# EAGLE design PIC32-RETROBSD_Rev.A (EAGLE 4.16)
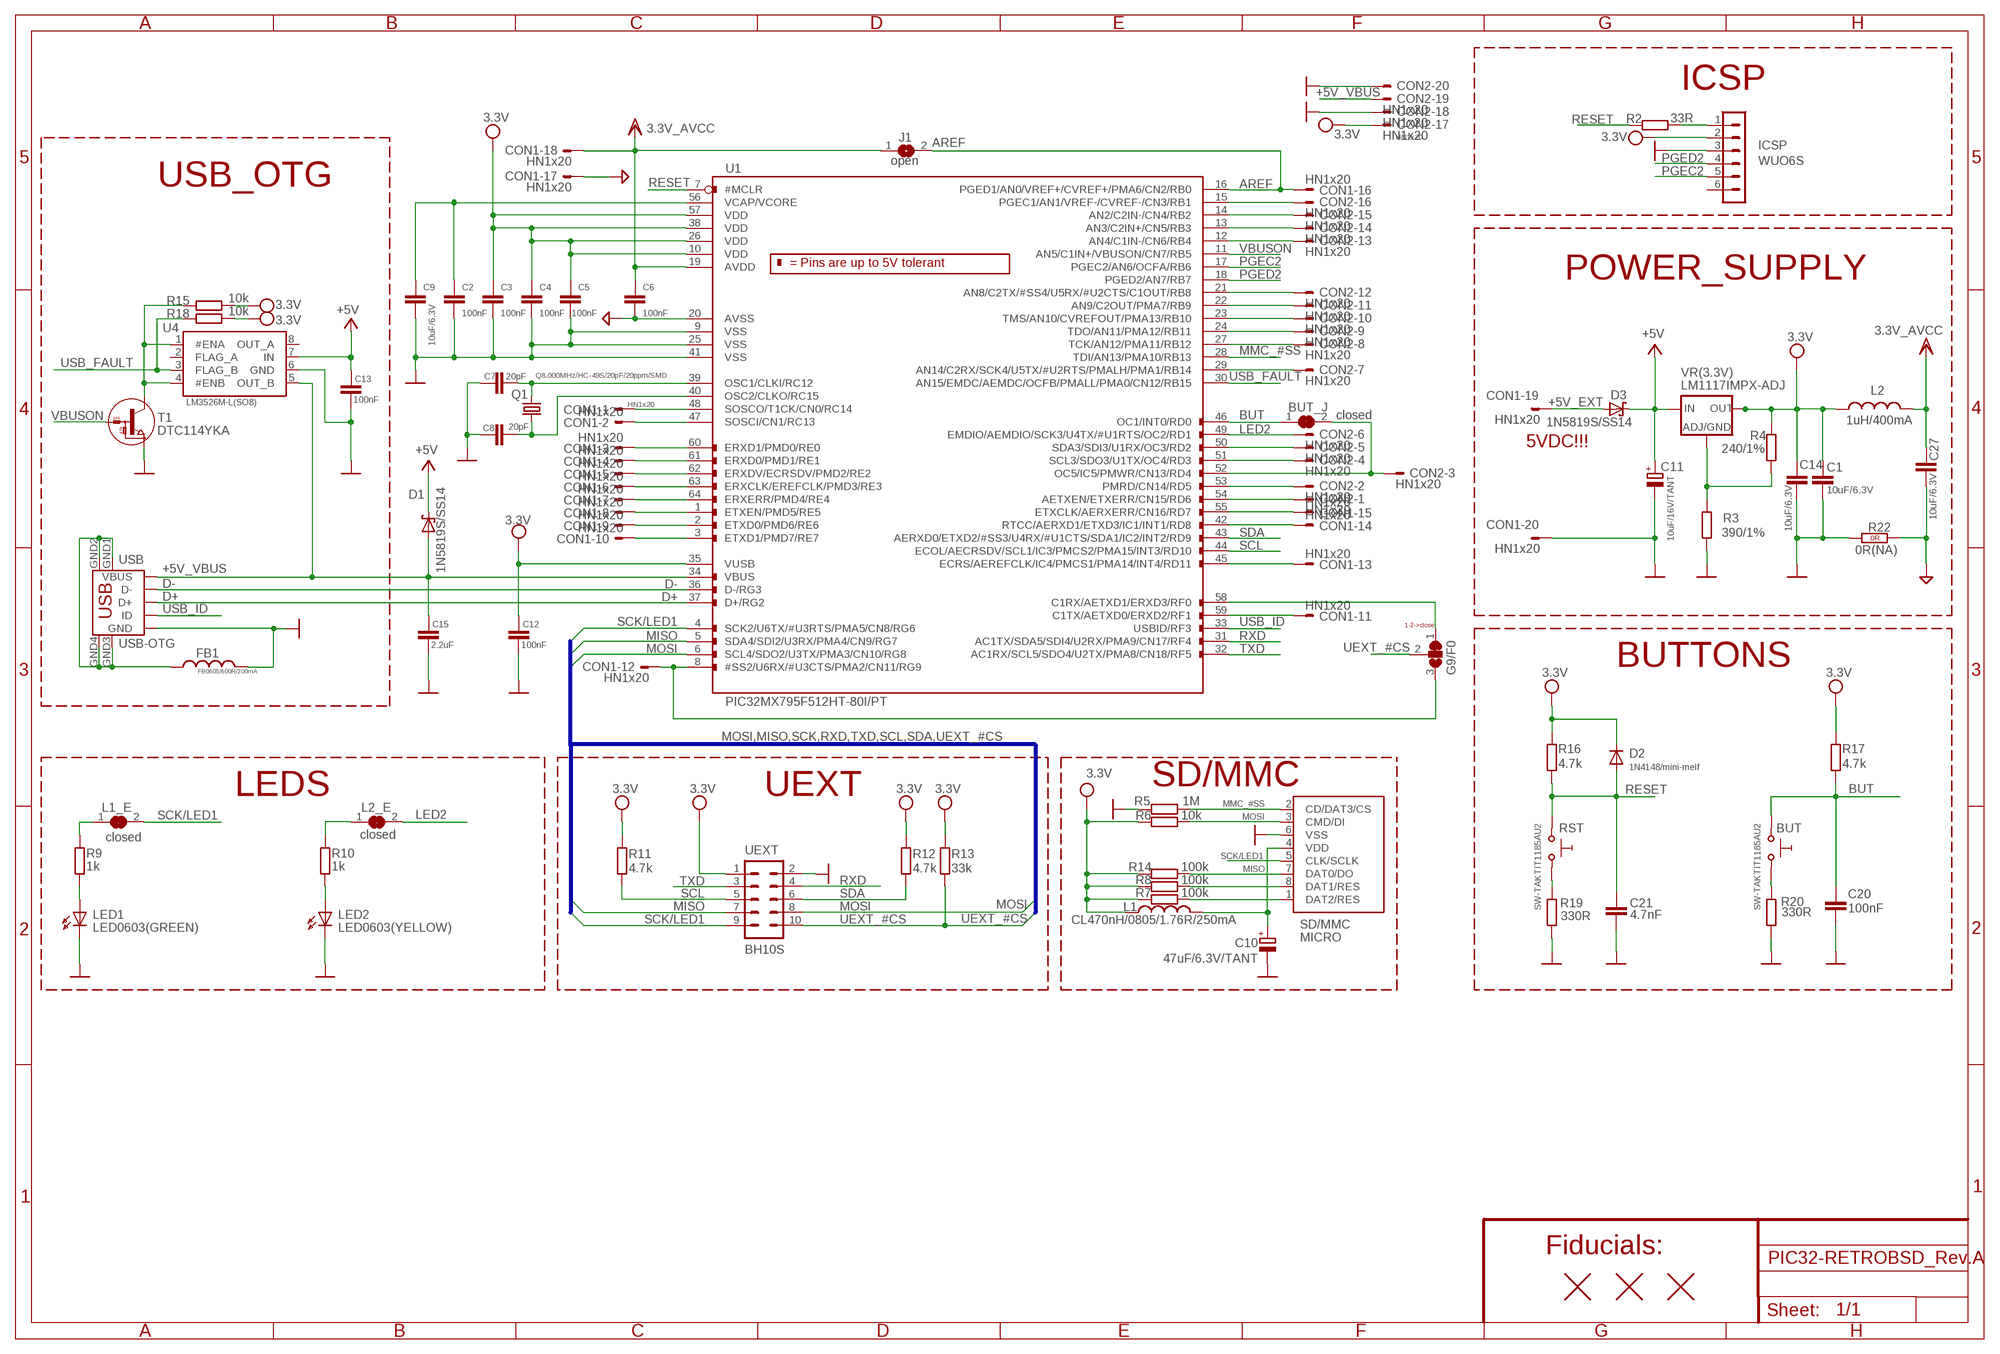
[diagram p0: schematic, sheet 1]

## Parts
BUT  SW-TAKTIT1185AU2  [IT1185AU2]
BUT_J  closed  SJSJ_1_SMALLER_CLOSE  [SJ_1_SMALLER_CLOSE]
C1  10uF/6.3V  C-EUC0805_5MIL  [C0805_5MIL]
C2  100nF  C-EUC0603_5MIL  [C0603_5MIL]
C3  100nF  C-EUC0603_5MIL  [C0603_5MIL]
C4  100nF  C-EUC0603_5MIL  [C0603_5MIL]
C5  100nF  C-EUC0603_5MIL  [C0603_5MIL]
C6  100nF  C-EUC0603_5MIL  [C0603_5MIL]
C7  20pF  C-EUC0603_5MIL  [C0603_5MIL]
C8  20pF  C-EUC0603_5MIL  [C0603_5MIL]
C9  10uF/6.3V  C-EUC0805_5MIL  [C0805_5MIL]
C10  47uF/6.3V/TANT  CPOL-EUCT3528  [CT3528]
C11  10uF/16V/TANT  CPOL-EUCT3528  [CT3528]
C12  100nF  C-EUC0603_5MIL  [C0603_5MIL]
C13  100nF  C-EUC0603_5MIL  [C0603_5MIL]
C14  10uF/6.3V  C-EUC0805_5MIL  [C0805_5MIL]
C15  2.2uF  C-EUC0603_5MIL  [C0603_5MIL]
C20  100nF  C-EUC0603_5MIL  [C0603_5MIL]
C21  4.7nF  C-EUC0603_5MIL  [C0603_5MIL]
C27  10uF/6.3V  C-EUC0805_5MIL  [C0805_5MIL]
CON1  HN1x20  CON20X1_2  [CON20X1]
CON2  HN1x20  CON20X1_2  [CON20X1]
D1  1N5819S/SS14  SCHOTKKY7.62SS2  [MLL-41]
D2  1N4148/mini-melf  DSMD  [MINI-MELF]
D3  1N5819S/SS14  SCHOTKKY7.62SS2  [MLL-41]
FB1  FB0605/600R/200mA  L-USL0603  [L0603]
G9/F0  SJ2W3  [SJ_2_SMALL]
ICSP  WUO6S  CON6WUO6S  [WU06S]
J1  open  SJSJ_SMALLER  [SJ_1_SMALLER]
L1  CL470nH/0805/1.76R/250mA  L-USL0805_5MIL  [L0805_5MIL]
L1_E  closed  SJSJ_1_SMALLER_CLOSE  [SJ_1_SMALLER_CLOSE]
L2  1uH/400mA  L-USL3216C  [L3216C]
L2_E  closed  SJSJ_1_SMALLER_CLOSE  [SJ_1_SMALLER_CLOSE]
LED1  LED0603(GREEN)  LED0603DWS  [LED-0603]
LED2  LED0603(YELLOW)  LED0603DWS  [LED-0603]
Q1  Q8.000MHz/HC-49S/20pF/20ppm/SMD  HC49/S1  [HC49/SMD2_THIN]
R2  33R  R-EU_R0603_5MIL  [R0603_5MIL]
R3  390/1%  R-EU_R0603_5MIL  [R0603_5MIL]
R4  240/1%  R-EU_R0603_5MIL  [R0603_5MIL]
R5  1M  R-EU_R0603_5MIL  [R0603_5MIL]
R6  10k  R-EU_R0603_5MIL  [R0603_5MIL]
R7  100k  R-EU_R0603_5MIL  [R0603_5MIL]
R8  100k  R-EU_R0603_5MIL  [R0603_5MIL]
R9  1k  R-EU_R0603_5MIL  [R0603_5MIL]
R10  1k  R-EU_R0603_5MIL  [R0603_5MIL]
R11  4.7k  R-EU_R0603_5MIL  [R0603_5MIL]
R12  4.7k  R-EU_R0603_5MIL  [R0603_5MIL]
R13  33k  R-EU_R0603_5MIL  [R0603_5MIL]
R14  100k  R-EU_R0603_5MIL  [R0603_5MIL]
R15  10k  R-EU_R0603_5MIL  [R0603_5MIL]
R16  4.7k  R-EU_R0603_5MIL  [R0603_5MIL]
R17  4.7k  R-EU_R0603_5MIL  [R0603_5MIL]
R18  10k  R-EU_R0603_5MIL  [R0603_5MIL]
R19  330R  R-EU_R0603_5MIL  [R0603_5MIL]
R20  330R  R-EU_R0603_5MIL  [R0603_5MIL]
R22  0R(NA)  R_0R0R(NA)  [0603_0R]
RST  SW-TAKTIT1185AU2  [IT1185AU2]
SD/MMC  MICRO  MICRO_SD/MMC  [TFR-MEM-CON]
T1  DTC114YKA  DIGITAL_TRANSISTORS-NPNDTC114YKA  [SOT-23]
U1  PIC32MX795F512HT-80I/PT  [LPTQFP64]
U4  LM3526M-L(SO8)  LM3526-L  [SO-8]
U$2  FIDUCIAL1X2  [FIDUCIAL-1X2]
U$3  FIDUCIAL1X2  [FIDUCIAL-1X2]
U$4  FIDUCIAL1X2  [FIDUCIAL-1X2]
UEXT  BH10S  ML10  [ML10-MALE]
USB  USB-OTG  MINI_USB9  [USB_MINI_9PIN]
VR(3.3V)  LM1117IMPX-ADJ  LM1117THERMAL_OFF  [SOT223_]

## Nets
+5V: C11.+ C13.2 D1.K(C) D3.K(C) U4.7(IN) VR(3.3V).3(IN)
+5V_EXT: CON1.19 D3.A
+5V_VBUS [pwr]: C15.2 CON2.19 D1.A U1.34(VBUS) U4.5(OUT_B) USB.VBUS
AGND: C6.2 C27.2 CON1.17 R22.2(1.2) U1.20(AVSS)
AREF: CON1.16 J1.2 U1.16(PGED1/AN0/VREF+/CVREF+/PMA6/CN2/RB0)
BUT: BUT.1 BUT_J.1 C20.1 R17.2 U1.46(OC1/INT0/RD0)
D+: U1.37(D+/RG2) USB.D+
D-: U1.36(D-/RG3) USB.D-
GND [pwr]: C1.2 C2.2 C3.2 C4.2 C5.2 C7.1 C8.1 C9.2 C10.- C11.- C12.1 C13.1 C14.2 C15.1 C20.2 C21.2 CON1.20 CON2.18 CON2.20 FB1.1 ICSP.3 LED1.C LED2.C R3.1 R5.2 R19.1 R20.1 R22.1(1.1) SD/MMC.6(VSS) T1.2(E) U1.9(VSS) U1.25(VSS) U1.41(VSS) U4.6(GND) UEXT.2 USB.GND
LED2: CON2.6 L2_E.2 U1.49(EMDIO/AEMDIO/SCK3/U4TX/#U1RTS/OC2/RD1)
MCIDAT1: R8.1 SD/MMC.8(DAT1/RES)
MCIDAT2: R7.1 SD/MMC.1(DAT2/RES)
MISO: R14.1 SD/MMC.7(DAT0/DO) U1.5(SDA4/SDI2/U3RX/PMA4/CN9/RG7) UEXT.7
MMC_#SS: R5.1 SD/MMC.2(CD/DAT3/CS) U1.28(TDI/AN13/PMA10/RB13)
MOSI: R6.1 SD/MMC.3(CMD/DI) U1.6(SCL4/SDO2/U3TX/PMA3/CN10/RG8) UEXT.8
N$1: R15.2 T1.3(C) U4.1(#ENA) U4.4(#ENB)
N$2: L1_E.1 R9.2
N$3: CON1.1 U1.48(SOSCO/T1CK/CN0/RC14)
N$4: CON1.2 U1.47(SOSCI/CN1/RC13)
N$5: LED2.A R10.1
N$6: CON1.3 U1.60(ERXD1/PMD0/RE0)
N$7: CON1.4 U1.61(ERXD0/PMD1/RE1)
N$8: CON1.5 U1.62(ERXDV/ECRSDV/PMD2/RE2)
N$9: CON1.6 U1.63(ERXCLK/EREFCLK/PMD3/RE3)
N$10: CON1.7 U1.64(ERXERR/PMD4/RE4)
N$11 [pwr]: R19.2 RST.2
N$12 [pwr]: BUT.2 R20.2
N$13: CON1.8 U1.1(ETXEN/PMD5/RE5)
N$14: CON1.9 U1.2(ETXD0/PMD6/RE6)
N$15: CON1.10 U1.3(ETXD1/PMD7/RE7)
N$16: C2.1 C9.1 U1.56(VCAP/VCORE)
N$17: C7.2 Q1.2 U1.39(OSC1/CLKI/RC12)
N$18: CON1.11 U1.59(C1TX/AETXD0/ERXD2/RF1)
N$19: C8.2 Q1.1 U1.40(OSC2/CLKO/RC15)
N$21: CON1.13 U1.45(ECRS/AEREFCLK/IC4/PMCS1/PMA14/INT4/RD11)
N$22: CON1.14 U1.42(RTCC/AERXD1/ETXD3/IC1/INT1/RD8)
N$23: LED1.A R9.1
N$24: CON1.15 U1.55(ETXCLK/AERXERR/CN16/RD7)
N$25: CON2.1 U1.54(AETXEN/ETXERR/CN15/RD6)
N$26: CON2.2 U1.53(PMRD/CN14/RD5)
N$27: R3.2 R4.1 VR(3.3V).1(ADJ/GND)
N$28: CON2.4 U1.51(SCL3/SDO3/U1TX/OC4/RD3)
N$29: CON2.5 U1.50(SDA3/SDI3/U1RX/OC3/RD2)
N$30: L2_E.1 R10.2
N$31: CON2.7 U1.29(AN14/C2RX/SCK4/U5TX/#U2RTS/PMALH/PMA1/RB14)
N$32: CON2.8 U1.27(TCK/AN12/PMA11/RB12)
N$33: CON2.9 U1.24(TDO/AN11/PMA12/RB11)
N$34: CON2.10 U1.23(TMS/AN10/CVREFOUT/PMA13/RB10)
N$35: CON2.11 U1.22(AN9/C2OUT/PMA7/RB9)
N$36: CON2.12 U1.21(AN8/C2TX/#SS4/U5RX/#U2CTS/C1OUT/RB8)
N$37: CON2.13 U1.12(AN4/C1IN-/CN6/RB4)
N$38: ICSP.1 R2.2
N$39: CON2.14 U1.13(AN3/C2IN+/CN5/RB3)
N$40: CON2.15 U1.14(AN2/C2IN-/CN4/RB2)
N$41: CON2.16 U1.15(PGEC1/AN1/VREF-/CVREF-/CN3/RB1)
N$42: BUT_J.2 CON2.3 U1.52(OC5/IC5/PMWR/CN13/RD4)
N$44: CON1.12 G9/F0.3 U1.8(#SS2/U6RX/#U3CTS/PMA2/CN11/RG9)
N$45: G9/F0.1 U1.58(C1RX/AETXD1/ERXD3/RF0)
N$116: C10.+ L1.2 SD/MMC.4(VDD)
PGEC2: ICSP.5 U1.17(PGEC2/AN6/OCFA/RB6)
PGED2: ICSP.4 U1.18(PGED2/AN7/RB7)
RESET: C21.1 D2.A R2.1 R16.2 RST.1 U1.7(#MCLR)
RXD: U1.31(AC1TX/SDA5/SDI4/U2RX/PMA9/CN17/RF4) UEXT.4
SCK/LED1: L1_E.2 SD/MMC.5(CLK/SCLK) U1.4(SCK2/U6TX/#U3RTS/PMA5/CN8/RG6) UEXT.9
SCL: R11.1 U1.44(ECOL/AECRSDV/SCL1/IC3/PMCS2/PMA15/INT3/RD10) UEXT.5
SDA: R12.1 U1.43(AERXD0/ETXD2/#SS3/U4RX/#U1CTS/SDA1/IC2/INT2/RD9) UEXT.6
TXD: U1.32(AC1RX/SCL5/SDO4/U2TX/PMA8/CN18/RF5) UEXT.3
UEXT_#CS: G9/F0.2 R13.1 UEXT.10
USB_FAULT: R18.2 U1.30(AN15/EMDC/AEMDC/OCFB/PMALL/PMA0/CN12/RB15) U4.3(FLAG_B)
USB_ID: U1.33(USBID/RF3) USB.ID
USB_SHIELD: FB1.2 USB.GND1 USB.GND2 USB.GND3 USB.GND4
VBUSON: T1.1(B) U1.11(AN5/C1IN+/VBUSON/CN7/RB5)
VCC: C1.1 C3.1 C4.1 C5.1 C12.2 C14.1 CON2.17 D2.C(K) ICSP.2 L1.1 L2.1 R4.2 R6.2 R7.2 R8.2 R11.2 R12.2 R13.2 R14.2 R15.1 R16.1 R17.1 R18.1 U1.10(VDD) U1.26(VDD) U1.35(VUSB) U1.38(VDD) U1.57(VDD) UEXT.1 VR(3.3V).2(OUT) VR(3.3V).4(RAD) ; supply symbol labelled 3.3V
VDD: C6.1 C27.1 CON1.18 J1.1 L2.2 U1.19(AVDD) ; supply symbol labelled 3.3V_AVCC
Unconnected: ICSP.6 U4.2(FLAG_A) U4.8(OUT_A)

## Buses
MOSI,MISO,SCK,RXD,TXD,SCL,SDA,UEXT_#CS

## Notes on the sheet
- ICSP
- USB_OTG
- POWER_SUPPLY
- 5VDC!!!
- 1-2->close
- BUTTONS
- LEDS | UEXT | SD/MMC
- Fiducials:

## Library data of the parts
BUT RST = gogo:SW-TAKT
BUT_J J1 L1_E L2_E = jumper:SJ: SMD solder JUMPER
C1-C9 C12-C15 C20 C21 C27 = rcl:C-EU: CAPACITOR, European symbol
C10 C11 = rcl:CPOL-EU: POLARIZED CAPACITOR, European symbol
CON1 CON2 = gogo:CON20X1_2
D1 D3 = gogo:SCHOTKKY7.62SS
D2 = DOUBLE-SIDE:D: DIODES
FB1 L1 L2 = rcl:L-US: INDUCTOR, American symbol
G9/F0 = jumper:SJ2W: SMD solder JUMPER
ICSP = Penko:CON6: CONNECTORS - 6 PINS
LED1 LED2 = DOUBLE-SIDE:LED
Q1 = crystal:HC49/S: CRYSTAL
R2-R20 = rcl:R-EU_: RESISTOR, European symbol
R22 = OLIMEX_DISCRET:R_0R
SD/MMC = OLIMEX_CONNECTORS:MICRO_SD/MMC
T1 = OLIMEX_DISCRET:DIGITAL_TRANSISTORS-NPN: DTC114YKA Digital Transistor - NPN
U1 = OLIMEX_IC:PIC32MX795F512H
U4 = OLIMEX_IC:LM3526-L: LM3526 Dual Port USB Power Switch and Over-Current Protection Features: -> Compatible with USB1.1 and USB2.0; -> 1 ms fault flag delay filters Hot-Plug events; -> Smooth turn-on eliminates in-rush induced voltage drop; -> UL recognized component: REF#205202; -> 1A nominal shortcircuit output current protects PC power supplies; -> Thermal shutdown protects device in direct short condition; -> 500mA minimum continuous load current; -> Small SO-8 package minimizes board space; -> 2.7V to 5.5V input voltage range; -> 140mOhm Max.switch resistance; -> 1 µA Max. standby current; -> 200µA Max. operating current; -> Under-voltage lockout(UVLO);
U$2-U$4 = SparkFunEagle-6-6-07:FIDUCIAL: Fiducial Alignment Points Various fiducial points for machine vision alignment.
UEXT = con-harting-ml:ML10: HARTING
USB = OLIMEX_CONNECTORS:MINI_USB9
VR(3.3V) = arm:LM1117

## Net classes
1 pwr: width 0.25 mm

## Board
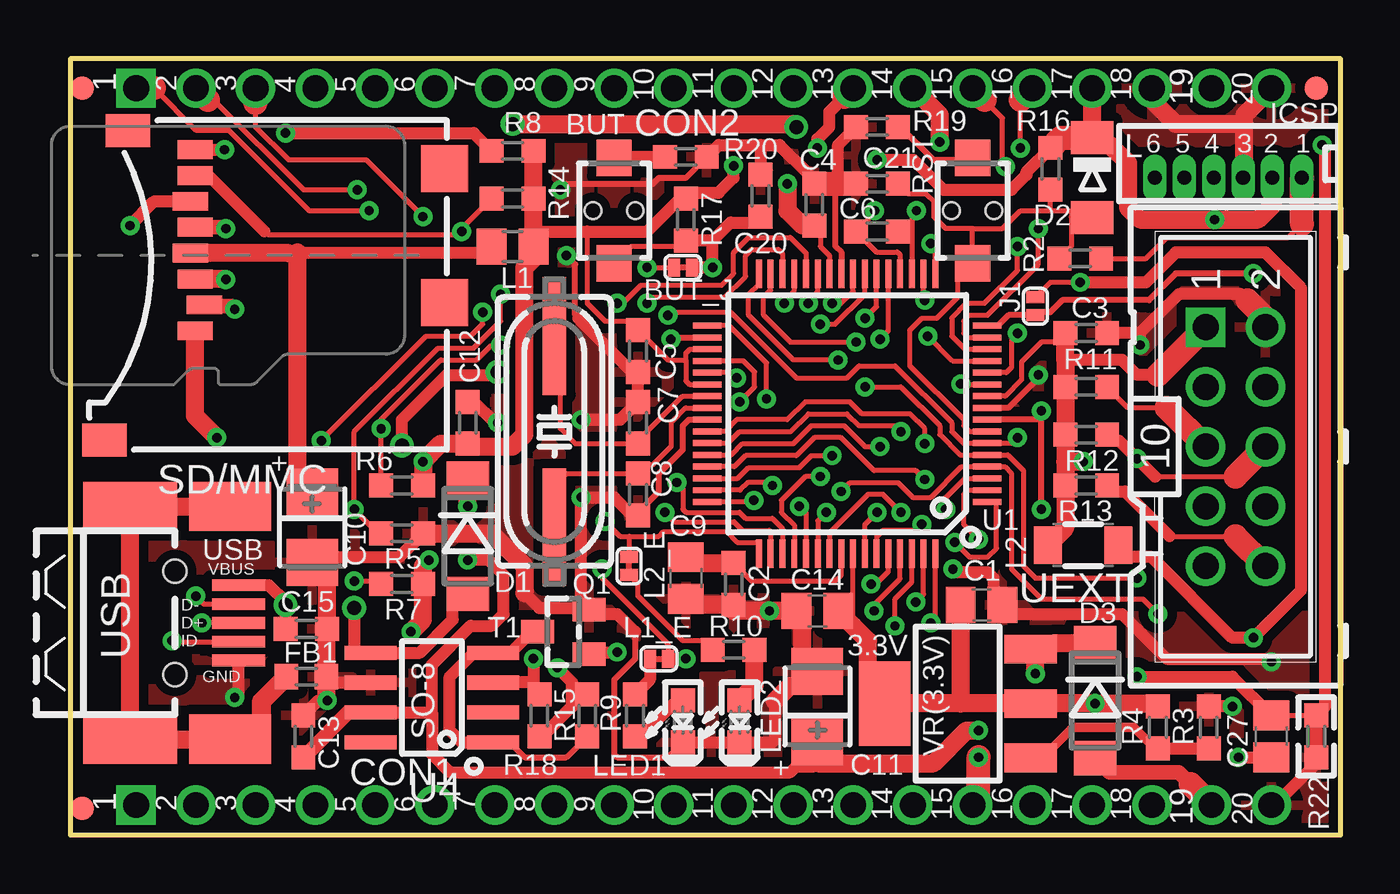
[diagram p1: board, top side]
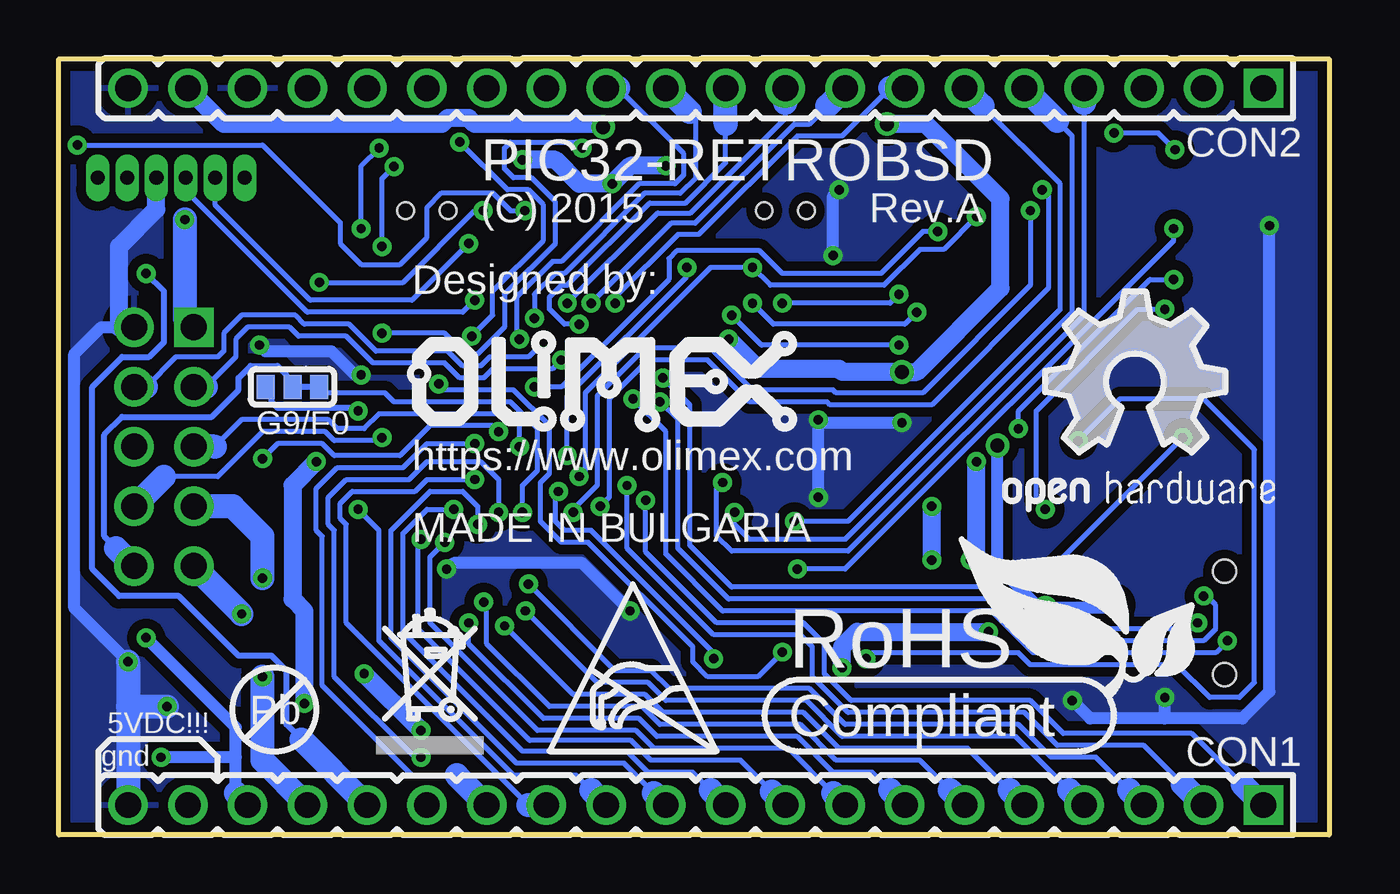
[diagram p2: board, bottom side, seen from below]

Size 54 x 33 mm. Coordinates in mm from the lower left corner, seen from the top.
Outline: 0,0 54,0 54,33 0,33 0,0
Copper layers (1+16): Top 0.035mm / dielectric 1.5mm / Bottom 0.035mm
Design rules "default": minimum track width 8mil, minimum drill 0.4mm, track to track 8mil, track to pad 8mil, pad to pad 8mil, via to via 8mil, smd to smd 1mil, copper to edge 10mil, drill to drill 8mil, minimum pad ring 8mil, minimum via ring 8mil, stop-mask expansion 4mil, vias tented up to drill 25mil, thermal gap 20mil

### Footprints (pad centres in the part's own frame; a part is rotated, then mirrored left to right if it is on the bottom)
IT1185AU2 = smd 1.55 x 1.5: 1 -2.25,0; 2 2.25,0 | hole 0.7: 0,-0.9; 0,0.9
SJ_1_SMALLER_CLOSE = smd 0.508 x 0.762: 1 -0.381,0; 2 0.381,0
C0805_5MIL = smd 1.27 x 1.524: 1 -0.889,0; 2 0.889,0
C0603_5MIL = smd 1.016 x 1.016: 1 -0.889,0; 2 0.889,0
CT3528 = smd 2 x 2.2: + -1.5,0; - 1.5,0
CON20X1 = drill 1.092 pad 1.676 square: 1 -24.13,0 | drill 1.092 pad 1.676 round: 2 -21.59,0; 3 -19.05,0; 4 -16.51,0; 5 -13.97,0; 6 -11.43,0; 7 -8.89,0; 8 -6.35,0; 9 -3.81,0; 10 -1.27,0; 11 1.27,0; 12 3.81,0; 13 6.35,0; 14 8.89,0; 15 11.43,0; 16 13.97,0; 17 16.51,0; 18 19.05,0; 19 21.59,0; 20 24.13,0
MLL-41 = smd 1.45 x 1.8: A 2.445,0; K -2.445,0
MINI-MELF = smd 1.4 x 1.8: A 1.7,0; C -1.7,0
L0603 = smd 1 x 1.1: 1 -0.85,0; 2 0.85,0
SJ_2_SMALL = smd 0.762 x 1.016: 1 -1.143,0; 2 0,0; 3 1.143,0
WU06S = drill 0.6 pad 0.991 long: 1 -3.125,0; 2 -1.875,0; 3 -0.625,0; 4 0.625,0; 5 1.875,0; 6 3.125,0
SJ_1_SMALLER = smd 0.508 x 0.762: 1 -0.381,0; 2 0.381,0
L0805_5MIL = smd 1.27 x 1.524: 1 -0.889,0; 2 0.889,0
L3216C = smd 1.2 x 1.6: 1 -1.5,0; 2 1.5,0
LED-0603 = smd 1.016 x 1.016: A 0.889,0; C -0.889,0
HC49/SMD2_THIN = smd 5 x 1: 1 -4.064,0; 2 4.064,0
R0603_5MIL = smd 1.016 x 1.016: 1 -0.889,0; 2 0.889,0
0603_0R = smd 1.016 x 1.016: 1 -0.889,0; 2 0.889,0
TFR-MEM-CON = smd 0.8 x 1.5: 1 -3.2,10.7; 2 -2.1,10.3; 3 -1,10.7; 4 0.1,10.9; 5 1.2,10.7; 6 2.3,10.9; 7 3.4,10.7; 8 4.5,10.7 | smd 2 x 2: 9 3.7,0.1; 10 -2,0.1 | smd 1.4 x 1.9: 11 5.3,13.55; 12 -7.85,14.55
SOT-23 = smd 1 x 1.4: 1 -0.95,-1.1; 2 0.95,-1.1; 3 0,1.1
LPTQFP64 = smd 1.2 x 0.254: 1 -5.95,3.75; 2 -5.95,3.25; 3 -5.95,2.75; 4 -5.95,2.25; 5 -5.95,1.75; 6 -5.95,1.25; 7 -5.95,0.75; 8 -5.95,0.25; 9 -5.95,-0.25; 10 -5.95,-0.75; 11 -5.95,-1.25; 12 -5.95,-1.75; 13 -5.95,-2.25; 14 -5.95,-2.75; 15 -5.95,-3.25; 16 -5.95,-3.75; 33 5.95,-3.75; 34 5.95,-3.25; 35 5.95,-2.75; 36 5.95,-2.25; 37 5.95,-1.75; 38 5.95,-1.25; 39 5.95,-0.75; 40 5.95,-0.25; 41 5.95,0.25; 42 5.95,0.75; 43 5.95,1.25; 44 5.95,1.75; 45 5.95,2.25; 46 5.95,2.75; 47 5.95,3.25; 48 5.95,3.75 | smd 0.254 x 1.2: 17 -3.75,-5.95; 18 -3.25,-5.95; 19 -2.75,-5.95; 20 -2.25,-5.95; 21 -1.75,-5.95; 22 -1.25,-5.95; 23 -0.75,-5.95; 24 -0.25,-5.95; 25 0.25,-5.95; 26 0.75,-5.95; 27 1.25,-5.95; 28 1.75,-5.95; 29 2.25,-5.95; 30 2.75,-5.95; 31 3.25,-5.95; 32 3.75,-5.95; 49 3.75,5.95; 50 3.25,5.95; 51 2.75,5.95; 52 2.25,5.95; 53 1.75,5.95; 54 1.25,5.95; 55 0.75,5.95; 56 0.25,5.95; 57 -0.25,5.95; 58 -0.75,5.95; 59 -1.25,5.95; 60 -1.75,5.95; 61 -2.25,5.95; 62 -2.75,5.95; 63 -3.25,5.95; 64 -3.75,5.95
SO-8 = smd 0.6 x 2.2: 1 -1.905,-2.6; 2 -0.635,-2.6; 3 0.635,-2.6; 4 1.905,-2.6; 5 1.905,2.6; 6 0.635,2.6; 7 -0.635,2.6; 8 -1.905,2.6
FIDUCIAL-1X2 = smd 1 x 1: 1 0,0
ML10-MALE = drill 1.1 pad 1.676 square: 1 -5.08,-1.27 | drill 1.1 pad 1.676 round: 2 -5.08,1.27; 3 -2.54,-1.27; 4 -2.54,1.27; 5 0,-1.27; 6 0,1.27; 7 2.54,-1.27; 8 2.54,1.27; 9 5.08,-1.27; 10 5.08,1.27
USB_MINI_9PIN = smd 2.25 x 0.5: D+ 2.706,0; D- 2.706,0.8; GND 2.706,-1.6; ID 2.706,-0.8; VBUS 2.706,1.6 | smd 4 x 2.1: GND1 -1.9,4.95; GND3 -1.9,-4.95 | smd 3.5 x 2.1: GND2 2.35,4.95; GND4 2.35,-4.95 | hole 1: 0,2.2; 0,-2.2
SOT223_ = smd 1.219 x 2.235: 1 -2.311,-3.099; 2 0,-3.099; 3 2.311,-3.099 | smd 3.6 x 2.2: 4 0,3.099

### Placement (x,y rotation side)
BUT  23.11,26.54 90 top
BUT_J  26.04,24.13 180 top
C1  38.73,9.78 0 top
C2  28.19,10.67 270 top
C3  43.18,21.34 0 top
C4  31.62,26.8 90 top
C5  24.13,20.57 270 top
C6  34.29,25.65 180 top
C7  24.13,17.53 270 top
C8  24.13,14.48 90 top
C9  26.16,10.92 270 top
C10  10.29,13.08 270 top
C11  31.75,5.46 90 top
C12  16.89,17.53 270 top
C13  9.91,4.19 270 top
C14  31.75,9.53 180 top
C15  10.03,8.76 180 top
C20  29.34,27.18 90 top
C21  34.29,27.69 180 top
C27  51.05,4.19 90 top
CON1  26.92,1.27 180 bottom
CON2  26.92,31.75 180 bottom
D1  16.89,12.7 270 top
D2  43.43,27.94 270 top
D3  43.56,5.71 270 top
FB1  10.03,6.73 180 top
G9/F0  44.07,19.05 180 bottom
ICSP  49.23,27.94 180 top
J1  41.02,22.48 270 top
L1  18.8,25.02 180 top
L1_E  25.02,7.49 0 top
L2  43.05,12.32 0 top
L2_E  23.75,11.43 90 top
LED1  26.04,4.83 90 top
LED2  28.45,4.83 90 top
Q1  20.57,17.14 90 top
R2  42.93,24.51 0 top
R3  48.39,4.57 270 top
R4  46.23,4.57 90 top
R5  14.1,12.83 0 top
R6  14.1,14.86 0 top
R7  14.1,10.67 0 top
R8  18.8,29.08 0 top
R9  24,5.08 90 top
R10  28.19,7.87 180 top
R11  43.18,19.05 180 top
R12  43.18,17.02 180 top
R13  43.18,14.86 180 top
R14  18.8,27.05 0 top
R15  21.97,5.08 270 top
R16  41.66,28.32 270 top
R17  26.16,26.16 270 top
R18  19.94,5.08 90 top
R19  34.29,30.1 0 top
R20  26.16,28.83 180 top
R22  52.96,4.19 90 top
RST  38.35,26.54 90 top
SD/MMC  16,24.64 90 top
T1  20.95,8.64 90 top
U1  33.02,17.91 180 top
U4  15.37,5.84 90 top
U$1  [PB_SMALL]  44.83,5.33 0 bottom
U$2  0.51,31.75 90 top
U$3  52.96,31.75 90 top
U$4  0.51,1.14 90 top
U$5  [LOGO-OPENHARDWARE_8X8]  8.26,19.18 0 bottom
U$8  [RECYCLE_BIN1/8]  40.51,3.43 0 bottom
U$11  [OLIMEX1_V]  21.46,17.02 0 bottom
U$13  [ESD_SYMBOL]  33.15,3.56 0 bottom
U$14  [ROHS]  22.99,4.19 0 bottom
UEXT  49.53,16.51 270 top
USB  4.45,9.02 0 top
VR(3.3V)  37.72,5.59 90 top

### Tracks (layer width: path | path; a pad name or v marks a point on that pad's centre or on a via)
+5V  (via drill 0.4)
  Top 0.203: 12.06,5.21 U4.7
  Top 0.508: U4.7 15.37,5.21 | 15.37,5.21 15.37,7.24 17.02,8.89 17.91,8.89 18.41,9.4 18.41,11.05 17.78,11.68 v16.89,11.68 | 31.75,3.05 31.62,2.92 30.86,2.92 30.61,2.67 16.13,2.67 15.37,3.43 15.37,5.21
  Top 0.61: C13.2 11.81,5.21 12.06,5.21
  Top 0.762: D3.K 41.81,8.16 41.55,7.9 VR(3.3V).3 41.02,7.7 v41.02,6.86 | C11.+ 31.75,3.05 36.7,3.05 38.1,4.45 v38.61,4.45 | v16.89,13.97 D1.K
  Bottom 0.762: v38.61,4.45 v41.02,6.86 | v16.89,11.68 v16.89,13.97
+5V_EXT
  Top 0.61: D3.A 44.16,2.67 47.12,2.67 47.62,2.16
  Top 1.016: 47.62,2.16 CON1.19
+5V_VBUS  (via drill 0.4, 0.6)
  Top 0.254: v25.53,21.08 25.6,21.16 U1.34
  Top 0.508: USB.VBUS 8.43,10.62 9.14,9.91 v9.14,9.78 C15.2 | D1.A 16.26,9.62 16.26,9.14 14.86,7.75 U4.5 12.06,7.75 v12.06,9.65 | v14.1,16.56 14.1,17.65 16,19.56 18.16,19.56 v18.16,19.68
  Top 0.762: v18.8,30.23 30.73,30.23 v30.86,30.1
  Bottom 0.508: v9.14,9.78 9.27,9.65 v12.06,9.65 12.32,9.65 14.1,11.43 v14.1,16.56
  Bottom 0.762: v25.53,21.08 24.26,19.81 20.83,19.81 20.7,19.68 v18.16,19.68 17.53,19.68 13.97,23.24 13.97,27.05 17.14,30.23 v18.8,30.23 | v30.86,30.1 30.99,30.23 36.32,30.23 36.58,30.48 37.47,30.48 37.72,30.23 46.99,30.23 CON2.19
AGND  (via drill 0.4)
  Top 0.203: C27.2 R22.2 | U1.20 35.27,24.67 35.15,24.79 34.27,24.79 C6.2 34.19,26.44 v34.19,26.54
  Top 0.508: C27.2 49.4,6.73 v45.34,6.73 | R22.2 53.34,5.46 53.34,29.21 v53.21,29.34
  Bottom 0.203: v53.21,29.34 45.34,29.34 42.04,26.04 42.04,25.15 41.15,24.26 39.5,24.26 38.35,25.4 38.35,26.67 37.72,27.3 35.56,27.3 34.8,26.54 v34.19,26.54
  Bottom 1.016: CON1.17 45.34,3.17 v45.34,6.73
AREF  (via drill 0.4)
  Top 0.254: U1.16 39.44,21.66 39.88,22.1 J1.2 41.15,22.23 41.66,22.23 42.16,22.73 45.85,22.73 46.99,23.88 v50.29,23.88
  Bottom 0.254: 43.69,4.06 44.32,4.7 44.32,6.99 44.96,7.62 46.35,7.62 48.9,10.16 51.44,10.16 52.58,11.3 52.58,19.05 51.31,20.32 50.16,20.32 49.53,20.95 49.53,23.11 v50.29,23.88
  Bottom 1.016: CON1.16 43.69,4.06
BUT  (via drill 0.4)
  Top 0.203: R17.2 25.91,25.02 23.84,25.02 BUT.1 | U1.46 28.36,15.16 28.83,15.62 30.99,15.62 31.5,16.13 v32.38,16.13
  Top 0.508: 27.3,25.27 28.07,26.04 29.08,26.04 C20.1 | 27.3,25.27 R17.2 | BUT_J.1 v27.3,24.13 27.3,25.27
  Bottom 0.203: v32.38,16.13 32.38,18.67 27.3,23.75 v27.3,24.13
D+  (via drill 0.4)
  Top 0.203: USB.D+ v5.59,9.02 | v28.32,19.43 28.09,19.66 U1.37
  Bottom 0.203: v5.59,9.02 5.84,8.76 12.32,8.76 14.1,10.54 25.4,10.54 27.18,12.32 27.18,18.29 v28.32,19.43
D-  (via drill 0.4)
  Top 0.203: USB.D- 5.68,9.82 v5.33,10.16 | v28.45,18.41 29.08,19.05 29.08,19.68 28.61,20.16 U1.36
  Bottom 0.203: v5.33,10.16 5.21,10.16 4.83,9.78 4.83,8.76 5.33,8.26 12.45,8.26 14.22,10.03 25.53,10.03 27.69,12.19 27.69,17.65 v28.45,18.41
GND  (via drill 0.4)
  Top 0.254: U1.25 32.77,24.79 32.51,25.04 32.51,27.69 | U1.9 39.87,18.16 41.15,19.43 v41.15,19.56 | LED1.C 25.4,3.3 23.24,3.3 23.11,3.43 23.11,6.6 24,7.49 24,8.64 | U1.41 26.29,17.66 26.04,17.4 26.04,16.38 25.02,15.37 25.02,14.61 24.13,13.72 C8.1 | R20.1 26.16,27.94 25.02,27.94 24.77,27.69 21.08,27.69 v20.83,27.43 | 21.59,21.97 21.46,22.1 21.46,24.26 v21.08,24.64
  Top 0.508: U4.6 10.92,6.48 v10.92,5.71 10.88,5.71 10.54,5.71 C13.1 | CON1.20 51.18,1.27 52.96,3.05 R22.1 | LED1.C LED2.C 29.84,3.94 29.97,4.06 29.97,5.71 | R19.1 32.64,29.34 32.64,27.69 32.51,27.69 | C8.1 23.88,13.59 23.11,14.35 v21.72,14.35 21.72,9.65 | v6.99,5.84 7.15,6.01 USB.GND | 50.04,22.73 49.78,22.99 47.12,22.99 45.47,21.34 | C4.2 31.37,27.94 31.37,28.12 30.15,29.34 29.34,29.34 | R20.1 27.56,29.34 29.34,29.34 | 29.34,29.34 C20.2 | 10.92,11.81 13.97,11.81 R5.2 | v51.05,7.37 50.93,7.49 46.61,7.49 44.7,9.4 40.01,9.4 C1.2 39.24,10.16 39.24,10.92 38.99,11.18 37.64,11.18 v37.52,11.3 | 21.59,21.97 23.88,19.68 C5.2 C7.1 23.37,17.65 v21.72,17.65 | 45.47,21.34 v45.47,20.83 | 45.47,21.34 C3.2 | v49.4,5.46 R3.1 | v18.16,17.53 18.03,17.53 17.14,18.41 C12.1 | 24,8.64 23.24,9.4 22.24,9.4 T1.2 21.99,9.65 21.72,9.65 | 19.3,10.29 19.94,9.65 21.72,9.65 | SD/MMC.6 3.57,26.94 v2.54,25.91
  Top 0.762: 10.88,5.71 FB1.1 10.88,8.72 C15.1 10.92,11.58 | CON2.18 45.97,31.24 46.99,30.23 49.91,30.23 | 49.91,30.23 49.91,30.61 CON2.20 | ICSP.3 49.91,28 49.91,30.23 | 10.92,11.58 C10.- | 10.92,11.58 10.92,11.81 | C9.2 26.42,9.78 C2.2 28.19,9.53 v29.72,9.53 C14.2 31.11,9.27 31.11,7.6 C11.- 31.14,6.35 30.61,6.35 29.97,5.71 29.95,5.69 | R5.2 17.91,12.83 19.3,11.43 19.3,10.29
  Top 1.016: 50.04,22.73 50.8,21.97 UEXT.2 | C4.2 32.51,27.69 | 32.64,27.69 C21.2
  Bottom 0.508: 6.99,4.95 10.16,4.95 v10.92,5.71 | 6.99,4.95 v6.99,5.84 | 6.99,4.95 3.68,4.95 2.54,6.1 v2.54,25.91 | v45.47,20.83 45.21,20.57 42.42,20.57 41.4,19.56 v41.15,19.56 | 51.44,21.59 52.2,21.59 53.34,20.45 53.34,9.65 v51.05,7.37 | v21.72,14.35 21.72,17.53 | v21.08,24.64 21.08,27.18 v20.83,27.43 | v29.72,9.53 31.75,11.56 37.21,11.56 37.47,11.3 v37.52,11.3 | 21.72,17.53 v21.72,17.65 | 21.72,17.53 v18.16,17.53
  Bottom 0.762: ICSP.3 49.85,26.6 51.44,25.02 51.44,21.59 UEXT.2
  Bottom 1.016: v51.05,7.37 51.05,5.46 | 51.05,5.46 CON1.20 | 51.05,5.46 v49.4,5.46
  pour Bottom (isolate 0.406, rank 2): 59.44,37.59 -6.22,37.59 -6.22,-5.97 59.44,-5.97
  pour Top (isolate 0.406, rank 2): 59.05,37.08 -6.22,37.08 -6.22,31.37 18.03,31.37 18.03,15.75 -6.22,15.75 -6.22,-4.7 59.05,-4.7
LED2  (via drill 0.4)
  Top 0.203: U1.49 29.27,12.39 29.21,12.45 28.35,12.45 27.89,12.9 25.22,12.9 25.02,12.7 23.75,12.7 | v22.73,13.34 23.37,12.7 23.75,12.7 | 23.75,12.7 L2_E.2
  Bottom 0.203: v22.73,13.34 20.45,13.34 11.43,22.35 11.43,27.69 14.73,30.99
  Bottom 1.016: 14.73,30.99 CON2.6
MCIDAT1  (via drill 0.4)
  Top 0.508: SD/MMC.8 v6.55,29.14 | v9.14,29.84 17.14,29.84 R8.1
  Bottom 0.203: v6.55,29.14 7.26,29.84 v9.14,29.84
MCIDAT2  (via drill 0.4)
  Top 0.203: v12.06,10.79 13.08,10.79 R7.1
  Top 0.762: SD/MMC.1 5.3,17.81 v6.22,16.89
  Bottom 0.203: v6.22,16.89 12.06,11.05 v12.06,10.79
MISO  (via drill 0.4)
  Top 0.203: 8.26,25.65 8.38,25.53 16.51,25.53 v16.64,25.65 16.64,25.78 17.78,26.92 17.78,27.05 R14.1 | v45.34,10.92 41.02,10.92 40.51,11.43 40.51,15.49 39.85,16.16 U1.5 37.82,16.16 36.96,17.02 36.96,17.4 35.31,19.05 v33.78,19.05
  Top 0.508: SD/MMC.7 5.87,28.04 8.26,25.65
  Bottom 0.203: v33.78,19.05 32.64,19.05 28.07,23.62 28.07,24.51 27.74,24.84 24.21,24.84 23.24,23.88 19.05,23.88 17.27,25.65 v16.64,25.65
  Bottom 1.016: v45.34,10.92 45.34,12.7 46.61,13.97 UEXT.7
MMC_#SS  (via drill 0.4)
  Top 0.203: R5.1 13.08,12.83 v12.06,13.84 12.06,17.14 15.62,20.7 17.14,20.7 18.29,21.84 v18.29,22.99 | U1.28 31.27,24.74 30.61,25.4 28.83,25.4 28.19,24.77 28.19,23.88 27.69,23.37 24.26,23.37 23.5,22.61 v23.24,22.61
  Top 0.61: SD/MMC.2 5.76,22.48 6.86,22.48 v6.99,22.35
  Bottom 0.203: v12.06,13.84 12.45,14.22 12.45,18.03 8.13,22.35 v6.99,22.35 | v18.29,22.99 18.67,22.61 v23.24,22.61
MOSI  (via drill 0.4)
  Top 0.203: v40.26,16.89 40.26,16.76 40.15,16.66 U1.6 37.95,16.66 37.47,17.14 37.47,17.53 35.05,19.94 33.53,19.94 33.02,19.43 30.86,19.43 28.07,22.23 25.53,22.23 v25.4,22.1 | R6.1 v13.21,17.27 13.21,17.65 15.75,20.19 17.27,20.19 17.91,20.83 v18.29,20.83
  Top 0.762: SD/MMC.3 6.59,23.64 v6.6,23.62
  Bottom 0.203: v40.26,16.89 40.39,16.76 42.29,16.76 42.67,17.14 45.34,17.14 47.24,15.24 49.53,15.24 | v13.21,17.27 13.21,18.03 7.62,23.62 v6.6,23.62 | v18.29,20.83 24.13,20.83 v25.4,22.1
  Bottom 1.016: 49.53,15.24 UEXT.8
N$1
  Top 0.254: U4.1 18.67,3.94 19.3,3.3 21.08,3.3 R15.2
  Top 0.508: T1.3 19.6,8.64 18.71,7.75 U4.4 17.14,7.75 16.13,6.73 16.13,4.45 16.64,3.94 U4.1
N$2
  Top 0.508: L1_E.1 24.64,6.6 R9.2
N$3  (via drill 0.4)
  Top 0.203: v29.06,14.22 28.99,14.16 U1.48
  Bottom 0.203: v29.06,14.22 29.06,12.04 26.04,9.02 22.35,9.02 21.46,8.13 21.46,6.86 20.32,5.71 12.7,5.71 11.3,4.32 5.84,4.32 3.68,2.16
  Bottom 1.016: CON1.1 3.68,2.16
N$4  (via drill 0.4)
  Top 0.203: U1.47 28.48,14.66 28.8,14.99 29.72,14.99 v29.84,14.86
  Bottom 0.203: 6.22,2.16 7.87,3.81 11.56,3.81 12.95,5.21 20.45,5.21 21.97,6.73 21.97,8 22.48,8.51 26.16,8.51 29.84,12.19 v29.84,14.86
  Bottom 1.016: CON1.2 6.22,2.16
N$5
  Top 0.762: LED2.A 29.08,6.35 R10.1
N$6  (via drill 0.4)
  Top 0.203: v34.04,10.67 34.23,10.67 34.77,11.2 U1.60
  Bottom 0.203: 8.51,1.91 9.91,3.3 11.81,3.3 13.21,4.7 20.57,4.7 22.1,6.22 28.07,6.22 28.83,6.99 30.35,6.99 v34.04,10.67
  Bottom 1.016: CON1.3 8.51,1.91
N$7  (via drill 0.4)
  Top 0.203: v34.16,9.53 34.16,9.78 35.27,10.89 U1.61
  Bottom 0.203: v34.16,9.53 31.11,6.48 28.96,6.48 28.19,5.71 22.23,5.71 20.7,4.19 13.34,4.19 11.05,1.91
  Bottom 1.016: CON1.4 11.05,1.91
N$8  (via drill 0.4)
  Top 0.203: U1.62 35.77,10.75 35.05,10.03 v35.05,8.89
  Bottom 0.203: v35.05,8.89 32.13,5.97 29.08,5.97 28.32,5.21 22.35,5.21 20.83,3.68 15.37,3.68 13.59,1.91
  Bottom 1.016: CON1.5 13.59,1.91
N$9  (via drill 0.4)
  Top 0.203: v35.94,9.91 36.27,10.23 U1.63
  Bottom 0.203: v35.94,9.91 35.81,9.78 35.81,8.13 33.15,5.46 29.21,5.46 28.45,4.7 22.48,4.7 20.95,3.17 17.4,3.17 16.13,1.91
  Bottom 1.016: CON1.6 16.13,1.91
N$10  (via drill 0.4)
  Top 0.203: v36.58,9.02 36.77,9.21 U1.64
  Bottom 0.203: v36.58,9.02 36.58,8.13 33.4,4.95 29.34,4.95 28.57,4.19 22.61,4.19 21.08,2.67 19.43,2.67 18.67,1.91
  Bottom 1.016: CON1.7 18.67,1.91
N$11
  Top 0.254: RST.2 38.26,28.7 36.68,28.7 35.28,30.1 R19.2
N$12
  Top 0.508: BUT.2 23.15,28.83 R20.2
N$13  (via drill 0.4)
  Top 0.203: v37.59,12.45 38.23,11.81 38.99,11.81 39.37,12.19 39.37,14.1 39.31,14.16 U1.1 38.54,14.16
  Bottom 0.203: 21.08,1.78 22.99,3.68 28.7,3.68 29.46,4.45 33.66,4.45 38.23,9.02 38.23,11.81 v37.59,12.45
  Bottom 1.016: CON1.8 21.08,1.78
N$14  (via drill 0.4)
  Top 0.203: v38.61,12.57 37.97,13.21 37.97,14.48 38.15,14.66 U1.2
  Bottom 0.203: 23.7,1.85 25.02,3.17 28.83,3.17 29.67,4.01 33.98,4.01 38.73,8.76 38.73,12.45 v38.61,12.57
  Bottom 1.016: CON1.9 23.7,1.85
N$15  (via drill 0.4)
  Top 0.203: v37.21,13.84 37.21,14.35 38.02,15.16 U1.3
  Bottom 0.203: 26.29,1.91 27.05,2.67 28.96,2.67 29.84,3.56 34.29,3.56 39.37,8.64 39.37,12.83 38.35,13.84 v37.21,13.84
  Bottom 1.016: CON1.10 26.29,1.91
N$16
  Top 0.203: U1.56 32.77,11.05 32.51,10.79 28.96,10.79 C2.1
  Top 0.762: C9.1 26.42,11.56 C2.1
N$17
  Top 0.203: Q1.2 20.83,20.95 20.83,17.27 21.46,16.64 C7.2 24.44,16.94 24.44,17.07 26.02,18.66 U1.39
N$18  (via drill 0.4)
  Top 0.203: v36.2,13.21 35.94,12.95 34.54,12.95 34.27,12.68 U1.59
  Bottom 0.203: v36.2,13.21 36.2,13.97 36.83,14.61 38.23,14.61 39.88,12.95 39.88,8.38 34.54,3.05 29.97,3.05 28.7,1.78
  Bottom 1.016: CON1.11 28.7,1.78
N$19
  Top 0.203: Q1.1 20.57,14.86 21.08,15.37 C8.2 24.51,15.75 24.77,15.75 25.55,16.53 25.55,17.55 26.16,18.16 U1.40
N$21  (via drill 0.4)
  Top 0.203: U1.45 28.23,15.66 28.7,16.13 30.86,16.13 31.62,16.89 32.77,16.89 34.16,15.49 35.94,15.49 v36.32,15.11
  Bottom 0.203: 34.04,1.27 41.78,9.02 41.78,13.21 42.04,13.46 42.04,14.1 41.53,14.61 38.86,14.61 38.35,15.11 v36.32,15.11
  Bottom 1.016: CON1.13 34.04,1.27
N$22  (via drill 0.4)
  Top 0.203: U1.42 27.82,17.16 28.32,17.65 30.48,17.65 31.24,18.41 33.15,18.41 33.66,17.91 35.69,17.91 36.32,17.27 v36.32,16.64
  Bottom 0.203: 37.08,2.54 38.99,2.54 42.8,6.35 42.8,12.7 43.05,12.95 43.05,14.73 42.16,15.62 39.37,15.62 38.35,16.64 v36.32,16.64
  Bottom 1.016: CON1.14 37.08,2.54
N$23
  Top 0.508: R9.1 24.26,4.19 25.78,5.71 LED1.A
N$24  (via drill 0.4)
  Top 0.203: v35.31,13.72 34.54,14.48 33.91,14.48 32.27,12.84 U1.55
  Top 1.016: CON1.15 38.61,1.52 v38.61,3.3
  Bottom 0.203: v35.31,13.72 35.31,15.11 36.07,15.88 38.35,15.88 39.12,15.11 41.78,15.11 42.55,14.35 42.55,13.21 42.29,12.95 42.29,6.73 38.86,3.3 v38.61,3.3
N$25  (via drill 0.4)
  Top 0.203: v32.13,13.72 31.77,13.36 U1.54 | 3.56,31.75 5.33,29.97 6.73,29.97 10.16,26.54 v12.7,26.54
  Top 1.016: CON2.1 3.56,31.75
  Bottom 0.203: v32.13,13.72 32.13,13.84 31.11,14.86 31.11,18.67 29.08,20.7 26.29,20.7 24.51,18.92 21.08,18.92 20.95,18.8 17.27,18.8 12.7,23.37 v12.7,26.54
N$26  (via drill 0.4)
  Top 0.203: v30.99,13.97 31.27,13.69 U1.53 | v12.19,27.43 9.91,27.43 6.1,31.24 5.84,31.24
  Top 1.016: 5.84,31.24 CON2.2
  Bottom 0.203: v30.99,13.97 30.61,14.35 30.61,18.54 28.96,20.19 26.42,20.19 24.64,18.41 21.34,18.41 21.21,18.29 16.89,18.29 11.94,23.24 11.94,27.18 v12.19,27.43
N$27
  Top 0.203: R4.1 R3.2
  Top 0.406: VR(3.3V).1 41.32,3.28 42.62,4.57 45.21,4.57 46.1,3.68 R4.1
  Top 0.508: R4.1 R3.2
N$28  (via drill 0.4)
  Top 0.203: U1.51 30.27,13.04 29.84,13.46 28.7,13.46 28.45,13.72 26.16,13.72 26.04,13.84 26.04,14.73 v25.78,14.99
  Bottom 0.203: 10.41,31.11 10.41,22.1 20.45,12.06 25.4,12.06 26.04,12.7 26.04,14.73 v25.78,14.99
  Bottom 1.016: 10.41,31.11 CON2.4
N$29  (via drill 0.4)
  Top 0.203: U1.50 29.77,12.9 29.72,12.95 28.57,12.95 28.22,13.31 25.68,13.31 v25.27,13.72
  Bottom 0.203: 11.56,30.35 10.92,29.72 10.92,22.23 20.57,12.57 24.64,12.57 25.27,13.21 v25.27,13.72
  Bottom 1.016: 11.56,30.35 CON2.5
N$30
  Top 0.203: L2_E.1 24.13,10.67 24.13,10.16 26.04,8.26 26.92,8.26 R10.2
N$31  (via drill 0.4)
  Top 0.203: v30.35,22.61 30.35,22.73 30.77,23.15 U1.29
  Bottom 0.203: v30.35,22.61 30.35,22.86 27.69,25.53 26.8,25.53 22.61,29.72 20.7,29.72 18.67,31.75
  Bottom 1.016: CON2.7 18.67,31.75
N$32  (via drill 0.4)
  Top 0.203: v31.37,22.61 31.37,22.73 31.77,23.13 U1.27
  Bottom 0.203: v31.37,22.61 27.96,26.01 26.95,26.01 22.73,30.23 22.1,30.23 21.34,30.99
  Bottom 1.016: 21.34,30.99 CON2.8
N$33  (via drill 0.4)
  Top 0.203: v32.38,22.61 32.77,22.61 33.27,23.11 U1.24
  Bottom 0.203: v32.38,22.61 28.55,26.44 27.15,26.44 23.11,30.48 23.11,31.11
  Bottom 1.016: 23.11,31.11 CON2.9
N$34  (via drill 0.4)
  Top 0.203: U1.23 33.77,22.98 32.51,21.72 v31.88,21.72
  Bottom 0.203: v31.88,21.72 32.51,21.72 33.15,22.35 33.15,22.86 32.64,23.37 32.38,23.37 28.88,26.87 27.36,26.87 25.65,28.57 25.65,30.23
  Bottom 1.016: 25.65,30.23 CON2.10
N$35  (via drill 0.4)
  Top 0.203: v33.78,21.97 34.27,22.46 U1.22
  Bottom 0.203: v33.78,21.97 33.78,22.99 32.89,23.88 32.51,23.88 29.11,27.28 27.58,27.28 26.92,27.94 26.92,30.48 27.18,30.73
  Bottom 1.016: 27.18,30.73 CON2.11
N$36  (via drill 0.4)
  Top 0.203: v34.42,21.08 34.77,21.43 U1.21
  Bottom 0.203: v34.42,21.08 34.54,21.21 34.54,22.86 33.02,24.38 32.64,24.38 29.34,27.69 27.81,27.69 27.43,28.07 27.43,28.96 30.23,31.75
  Bottom 1.016: 30.23,31.75 CON2.12
N$37  (via drill 0.4)
  Top 0.203: U1.12 39.78,19.66 40.01,19.88 40.01,21.08 v40.26,21.34
  Top 0.508: v31.75,29.21 31.75,29.59 32.26,30.1 32.26,30.73 32.89,31.37
  Top 1.016: 32.89,31.37 CON2.13
  Bottom 0.203: v40.26,21.34 37.59,21.34 36.7,20.45 36.2,20.45 35.05,21.59 35.05,22.99 32.89,25.15 32.89,26.92 33.91,27.94 34.67,27.94 35.05,28.32 35.05,29.21 34.8,29.46 32,29.46 v31.75,29.21
N$38
  Top 0.203: 52.35,25.98 51.77,25.4 46.61,25.4 45.72,24.51 R2.2
  Top 1.016: 52.35,25.98 ICSP.1
N$39  (via drill 0.4)
  Top 0.203: U1.13 37.5,20.16 v36.45,21.21
  Top 0.762: v36.96,29.46 36.96,30.61 CON2.14
  Bottom 0.203: v36.96,29.46 34.92,27.43 34.04,27.43 33.4,26.8 33.4,25.27 35.56,23.11 35.56,22.1 v36.45,21.21
N$40  (via drill 0.4)
  Top 0.203: v39.75,28.42 39.62,28.55 39.62,30.48 38.86,31.24 | U1.14 38.02,20.66 37.47,21.21 37.47,21.97 38.1,22.61 38.86,22.61 40.26,24 v40.26,25.02
  Top 1.016: 38.86,31.24 CON2.15
  Bottom 0.203: v40.26,25.02 40.26,27.91 v39.75,28.42
N$41  (via drill 0.4)
  Top 0.203: U1.15 38.15,21.16 37.97,21.34 37.97,21.84 38.23,22.1 38.99,22.1 41.15,24.26 v41.15,25.78 | v40.39,29.21 40.39,31.24
  Top 1.016: 40.39,31.24 CON2.16
  Bottom 0.203: v41.15,25.78 41.15,28.45 v40.39,29.21
N$42  (via drill 0.4)
  Top 0.203: v31.88,15.24 31.24,15.24 30.23,14.22 30.23,13.72 30.77,13.17 U1.52 | v14.99,26.29 12.57,28.7 9.27,28.7 7.87,30.1 7.87,31.11 | v24.51,24.13 BUT_J.2
  Top 1.016: 7.87,31.11 CON2.3
  Bottom 0.203: v31.88,15.24 31.62,15.49 31.62,18.8 26.29,24.13 v24.51,24.13 23.75,23.37 18.92,23.37 17.4,24.89 16.38,24.89 v14.99,26.29
N$44  (via drill 0.4)
  Top 0.254: 41.27,17.66 v41.27,18.03 | 41.27,17.66 U1.8 | v41.27,13.84 41.27,17.66
  Bottom 0.203: 31.37,1.91 32,2.54 34.67,2.54 40.39,8.26 40.39,12.95 v41.27,13.84
  Bottom 0.254: v41.27,18.03 41.4,18.16 44.7,18.16 44.96,18.41 44.96,18.8 G9/F0.3
  Bottom 1.016: CON1.12 31.37,1.91
N$45  (via drill 0.4)
  Top 0.203: v34.29,13.72 33.77,13.2 U1.58
  Bottom 0.203: G9/F0.1 42.67,18.8 40.13,18.8 39.75,18.41 34.8,18.41 33.66,17.27 33.66,15.49 34.29,14.86 v34.29,13.72
  Bottom 0.254: G9/F0.1 44.07,19.05
N$116
  Top 0.203: 9.65,24.77 9.3,24.77 9.3,24.74
  Top 0.508: 9.65,24.77 17.65,24.77 L1.2
  Top 0.762: 9.3,24.74 SD/MMC.4 | C10.+ 9.65,15.22 9.65,24.77
PGEC2  (via drill 0.4)
  Top 0.203: U1.17 36.77,24.95 v36.58,25.15
  Bottom 0.203: v36.58,25.15 38.99,22.73 43.31,22.73 47.35,26.78 ICSP.5
PGED2  (via drill 0.4)
  Top 0.203: U1.18 36.27,22.79 v36.32,22.73
  Bottom 0.203: v36.32,22.73 36.83,22.23 43.43,22.23 48.6,27.39 ICSP.4
RESET
  Top 0.203: 42.55,26.29 43.38,26.29 D2.A | 42.55,26.29 42.55,25.02 R2.1 | 41.66,26.54 R16.2 | U1.7 38.22,17.16 37.97,17.4 37.97,17.65 35.69,19.94 35.69,21.46 36.2,21.97 36.83,21.97 37.72,22.86 37.72,23.66 RST.1 38.35,25.78 | 38.35,25.78 39.62,25.78 40.39,26.54 41.66,26.54 | 41.66,26.54 42.55,26.54 42.55,26.29 | C21.1 35.61,27.25 36.37,27.25 36.7,26.92 36.7,26.29 37.21,25.78 38.35,25.78
RXD  (via drill 0.4)
  Top 0.203: U1.31 29.77,23.17 29.46,22.86 29.46,22.1 30.61,20.95 v33.4,20.95
  Bottom 0.203: 50.29,19.05 49.02,20.32 47.24,20.32 46.99,20.57 46.99,21.34 46.23,22.1 43.94,22.1 43.56,21.72 41.66,21.72 40.51,20.57 37.47,20.57 36.83,19.94 36.07,19.94 35.69,20.32 34.04,20.32 v33.4,20.95
  Bottom 1.016: 50.29,19.05 UEXT.4
SCK/LED1  (via drill 0.4)
  Top 0.203: v46.23,9.4 45.59,10.03 41.27,10.03 40.01,11.3 40.01,15.37 39.72,15.66 U1.4 37.88,15.66 36.58,14.35 35.81,14.35 35.18,14.99 33.15,14.99 v32.77,14.61 | v22.61,11.3 22.61,10.92 25.4,8.13 L1_E.2
  Top 0.508: L1_E.2 v26.16,7.49
  Top 0.61: SD/MMC.5 6.55,25.84 v6.6,25.78
  Bottom 0.203: v22.61,11.3 20.57,11.3 6.6,25.27 v6.6,25.78 | v26.16,7.49 26.16,7.75 31.37,12.95 32.51,12.95 32.89,13.34 32.89,14.48 v32.77,14.61
  Bottom 1.016: v46.23,9.4 UEXT.9
SCL  (via drill 0.4)
  Top 0.203: R11.1 44.96,18.16 46.61,18.16 | U1.44 28.09,16.16 28.57,16.64 30.73,16.64 31.5,17.4 32.89,17.4 33.78,16.51 v34.42,16.51
  Top 1.016: UEXT.5 46.61,18.16
  Bottom 0.203: v34.42,16.51 34.42,17.4 34.92,17.91 40.39,17.91 41.02,17.27 42.16,17.27 42.55,17.65 46.23,17.65 47.37,16.51
  Bottom 1.016: 47.37,16.51 UEXT.5
SDA  (via drill 0.4)
  Top 0.203: 46.1,15.24 49.53,15.24 | U1.43 27.96,16.66 28.45,17.14 30.61,17.14 31.37,17.91 33.02,17.91 33.53,17.4 35.05,17.4 v35.31,17.14
  Top 0.508: R12.1 44.32,16.76 44.58,16.76 v45.34,16 46.1,15.24
  Top 1.016: 49.53,15.24 UEXT.6
  Bottom 0.203: v35.31,17.14 35.56,17.4 38.23,17.4 39.5,16.13 42.29,16.13 42.8,16.64 44.7,16.64 v45.34,16
TXD  (via drill 0.4)
  Top 0.203: U1.32 29.27,23.43 28.83,22.99 28.83,22.1 30.73,20.19 v32.64,20.19
  Bottom 0.203: v32.64,20.19 33.02,19.81 35.56,19.81 35.94,19.43 36.96,19.43 37.59,20.07 40.64,20.07 41.78,21.21 43.81,21.21 44.2,21.59 45.97,21.59 46.48,21.08 46.48,20.32 47.75,19.05
  Bottom 1.016: 47.75,19.05 UEXT.3
UEXT_#CS
  Top 0.203: 46.74,12.7 49.53,12.7
  Top 0.508: 46.74,12.7 44.83,14.61 44.32,14.61 R13.1
  Top 1.016: 49.53,12.7 UEXT.10
  Bottom 0.254: 51.56,12.19 52.07,12.7 52.07,17.02 51.31,17.78 47.5,17.78 46.35,18.92 46.35,19.43 45.85,19.94 44.7,19.94 44.32,19.56 44.32,19.3 G9/F0.2
  Bottom 1.016: UEXT.10 51.56,12.19
USB_FAULT  (via drill 0.4)
  Top 0.203: U1.30 30.27,24.72 30.1,24.89 28.96,24.89 28.7,24.64 28.7,23.75 27.81,22.86 24.77,22.86 v24.51,22.61 | v10.67,16.76 15.11,21.21 17.02,21.21 17.53,21.72 v17.53,22.23
  Top 0.508: 19.68,6.48 19.68,6.22 R18.2 | 19.68,6.48 U4.3 | v19.68,7.49 19.68,6.48
  Bottom 0.203: v19.68,7.49 19.43,7.75 13.21,7.75 12.7,7.24 6.48,7.24 5.08,5.84 3.81,5.84 3.17,6.48 3.17,16.38 5.33,18.54 8.89,18.54 v10.67,16.76 | v17.53,22.23 18.03,21.72 23.62,21.72 v24.51,22.61
USB_ID  (via drill 0.4)
  Top 0.203: v4.32,8.26 4.36,8.22 USB.ID | v29.59,18.54 29.59,20.07 28,21.66 U1.33
  Bottom 0.203: v4.32,8.26 4.83,7.75 12.57,7.75 14.35,9.53 25.78,9.53 28.19,11.94 28.19,17.14 v29.59,18.54
USB_SHIELD
  Top 0.762: USB.GND2 USB.GND1 USB.GND3 USB.GND4
  Top 0.813: FB1.2 8.13,5.68 8.13,4.7 7.5,4.07 USB.GND4
VBUSON  (via drill 0.4)
  Top 0.203: v37.85,19.18 37.83,19.16 U1.11 | T1.1 22.12,7.62
  Top 0.508: 22.12,7.62 22.27,7.77 v23.24,7.77
  Bottom 0.203: v37.85,19.18 37.59,18.92 34.67,18.92 33.15,17.4 33.15,15.37 33.53,14.99 33.53,13.34 32.64,12.45 31.5,12.45 27.05,8 27.05,7.37 26.42,6.73 24.28,6.73 v23.24,7.77
VCC  (via drill 0.4)
  Top 0.203: 46.1,5.59 R4.2 | 33.27,8.89 U1.57 | U1.26 32.27,24.63 31.88,25.02 31.88,25.65 C4.1 | U1.35 26.33,20.66 26.16,20.49 26.16,20.19 | 26.16,20.19 25.4,20.19 24.26,21.34 24.13,21.34 C5.1 23.75,21.84 22.73,21.84 21.97,22.61 21.97,25.65 | 49.15,26.16 v48.64,26.16 | U1.10 39.74,18.66 40.44,19.36 40.44,20.12 41.27,20.95 41.91,20.95 C3.1 | U1.38 26.31,19.16 26.16,19.3 26.16,20.19
  Top 0.508: R18.1 20.07,4.19 21.34,5.46 21.34,5.97 | 19.68,25.65 21.97,25.65 24.51,25.65 25.91,27.05 R17.1 26.42,27.3 27.56,27.3 28.19,27.94 v28.19,28.45 | v34.29,28.7 35.84,28.7 37.11,27.43 40.01,27.43 40.64,28.07 40.64,28.19 R16.1 | 46.23,19.56 45.34,19.56 44.7,20.19 42.29,20.19 | 21.34,5.97 R15.1 | 21.34,5.97 21.34,6.48 v20.7,7.11
  Top 0.762: 46.1,5.59 v43.56,5.59 VR(3.3V).2 37.85,5.59 | 42.29,15.88 R12.2 R11.2 42.29,20.19 C3.1 | 42.29,15.88 v43.05,15.88 | 42.29,15.88 R13.2 42.29,13.06 L2.1 | 33.27,8.89 C14.1 | 33.27,8.89 33.91,8.25 33.91,5.59 VR(3.3V).4 37.85,5.59 | 37.85,5.59 C1.1 | R8.2 R14.2 19.68,25.65 19.68,25.4 | CON2.17 D2.C 43.74,29.34 44.2,29.34 44.96,28.57 44.96,26.67 45.47,26.16 49.15,26.16 50.49,26.16 51.1,26.77 ICSP.2 | v30.48,27.69 30.48,26.54 31.11,25.91 C4.1 | R6.2 v14.99,15.88 15.75,16.64 C12.2 17.02,16.51 18.8,16.51 19.3,17.02 19.3,24.13 19.68,24.51 19.68,25.4 | v15.24,11.68 14.99,11.43 R7.2 14.99,9.14 v14.48,8.64 | 19.68,25.4 L1.1
  Top 1.016: R16.1 42.09,29.64 D2.C | UEXT.1 46.23,19.56
  Bottom 0.762: v28.19,28.45 29.72,28.45 v30.48,27.69 31.88,27.69 32.89,28.7 v34.29,28.7 | v15.24,11.68 14.99,11.94 v14.99,15.88 | v43.05,15.88 44.07,14.86 44.07,10.03 43.56,9.53 v43.56,5.59 | v20.7,7.11 20.7,8 20.07,8.64 v14.48,8.64
  Bottom 1.016: v48.64,26.16 48.64,21.97 UEXT.1
VDD  (via drill 0.4)
  Top 0.203: 35.77,25.65 C6.1 | v35.97,26.54 35.94,26.54 35.77,26.37 35.77,25.65 | 35.77,25.65 U1.19 | 43.56,23.5 41.66,23.5 J1.1
  Top 0.508: L2.2 45.06,11.81 45.97,11.81 49.4,8.38 v50.29,8.38 52.32,10.41 52.32,23.24 50.8,24.77 46.99,24.77 45.72,23.5 43.56,23.5 v42.93,23.5 | v49.66,3.3 C27.1
  Bottom 0.203: v42.93,23.5 39.37,23.5 36.32,26.54 v35.97,26.54
  Bottom 0.508: v50.29,8.38 46.48,4.57 46.48,1.78 46.48,3.3 v49.66,3.3
  Bottom 1.016: CON1.18 46.48,1.78

### Text on the board
tNames: 1 | 2 | 3 | 4 | 5 | 6 | 7 | 8 | 9 | 10 | 11 | 12 | 13 | 14 | 15 | 16 | 17 | 18 | 19 | 20 | + | 3.3V | + | 1 | 2 | 3 | 4 | 5 | 6 | 7 | 8 | 9 | 10 | 11 | 12 | 13 | 14 | 15 | 16 | 17 | 18 | 19 | 20
bNames: PIC32-RETROBSD | Rev.A | (C) 2015 | Designed by: | https://www.olimex.com | MADE IN BULGARIA | 5VDC!!! | gnd
213bmp: POLIGONI NA CIFROVOTO ZAHRANVANE I CHARGERA